# Altium project USBTinyISP.PrjPcb
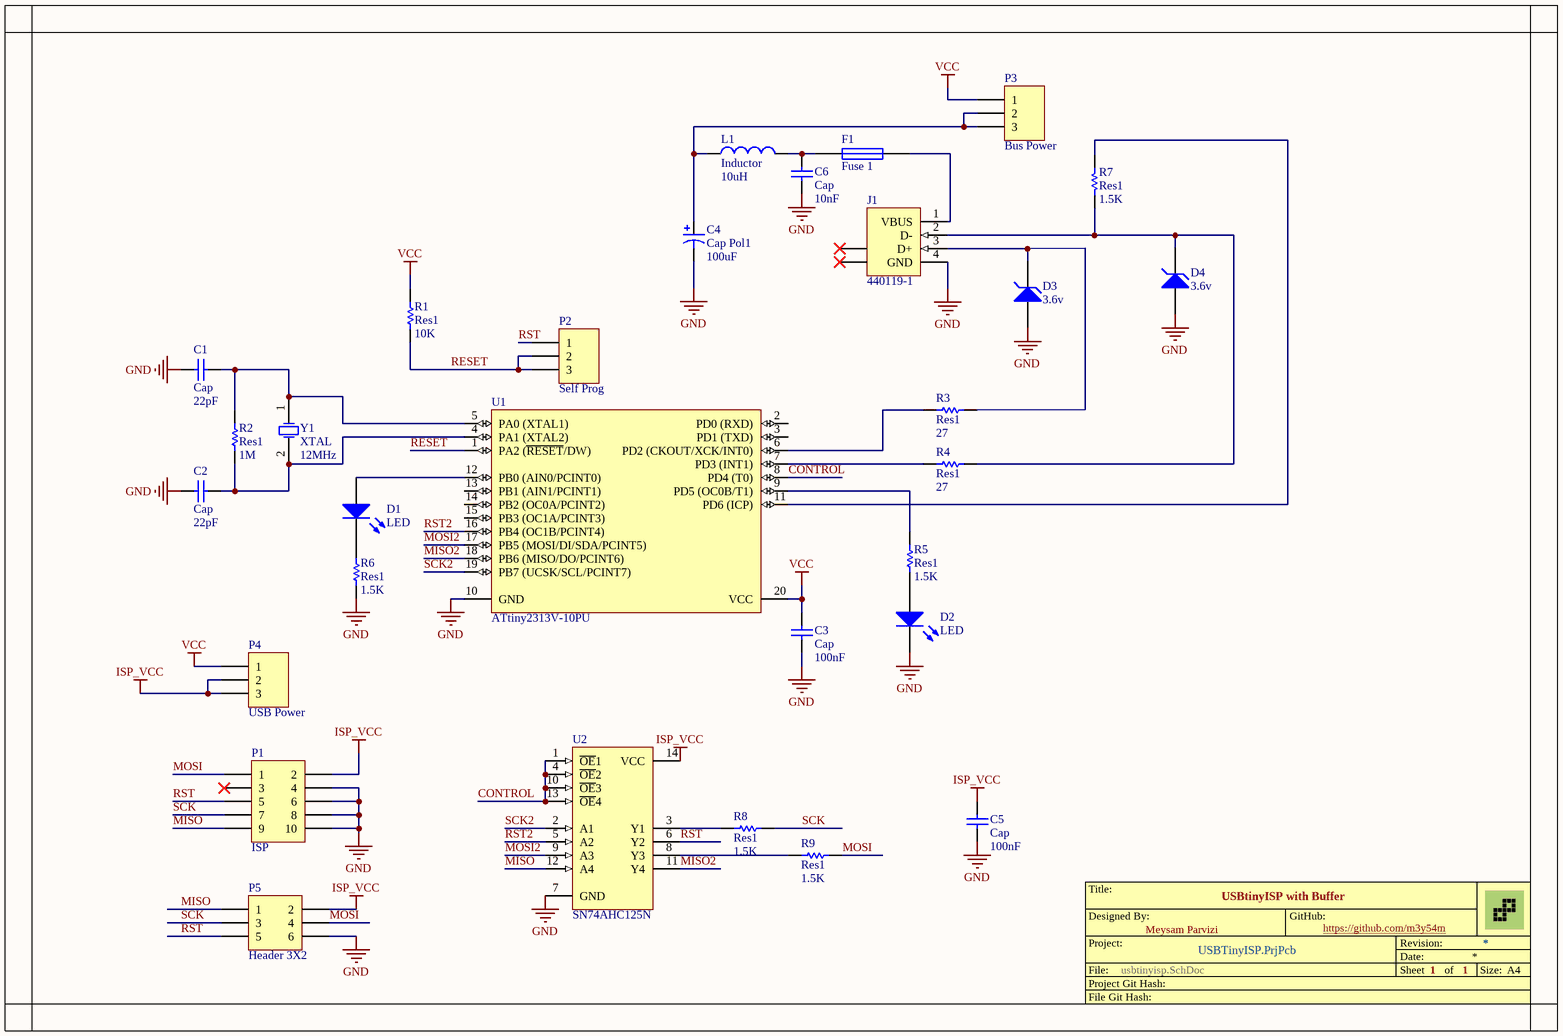
[diagram p0: usbtinyisp.SchDoc]
1 sheet, 30 parts. Net scope: global (net labels, ports and power ports of the same name join across sheets).
Board file: usbtinyisp.PcbDoc

## Sheet usbtinyisp.SchDoc: USBtinyISP with Buffer
size A4; Author: Meysam Parvizi; DrawnBy: Meysam Parvizi; Engineer: Meysam Parvizi; SheetNumber: 1; SheetTotal: 1

### Parts
C1  Cap  value 22pF  [C1206]
C2  Cap  value 22pF  [C1206]
C3  Cap  value 100nF  [C1206]
C4  Cap Pol1  value 100uF  [CAP-SMD1]
C5  Cap  value 100nF  [C1206]
C6  Cap  value 10nF  [C1206]
D1  LED  [3.5X2.8X1.9]
D2  LED  [3.5X2.8X1.9]
D3  3.6v  [DIODE-S]
D4  3.6v  [DIODE-S]
F1  Fuse 1  [C1206]
J1  440119-1  [440119]
L1  Inductor  value 10uH  [C1206]
P1  ISP  [BOX2X5]
P2  Self Prog  [HDR1X3]
P3  Bus Power  [HDR1X3]
P4  USB Power  [HDR1X3]
P5  Header 3X2  [HDR2X3]
R1  Res1  value 10K  [C1206]
R2  Res1  value 1M  [C1206]
R3  Res1  value 27  [C1206]
R4  Res1  value 27  [C1206]
R5  Res1  value 1.5K  [C1206]
R6  Res1  value 1.5K  [C1206]
R7  Res1  value 1.5K  [C1206]
R8  Res1  value 1.5K  [C1206]
R9  Res1  value 1.5K  [C1206]
U1  ATtiny2313V-10PU  [DIP20]
U2  SN74AHC125N  [DIP14]
Y1  XTAL  value 12MHz  [XTAL]

### Nets
GND: C1.1 C2.1 C3.1 C4.2 C5.1 C6.1 D2.2(K) D3.1(A) D4.1(A) J1.4(GND) P1.4 P1.6 P1.8 P1.10 P5.6 R6.2 U1.10(GND) U2.7(GND)
ISP_VCC: C5.2 P1.2 P4.2 P4.3 P5.2 U2.14(VCC)
VCC: C3.2 P3.1 P4.1 R1.2 U1.20(VCC)
CONTROL: U1.8(PD4_(T0)) U2.1(~{OE}1) U2.4(~{OE}2) U2.10(~{OE}3) U2.13(~{OE}4)
MISO: P1.9 P5.1 U2.12(A4)
MISO2: U1.18(PB6_(MISO/DO/PCINT6)) U2.11(Y4)
MOSI: P1.1 P5.4 R9.2
MOSI2: U1.17(PB5_(MOSI/DI/SDA/PCINT5)) U2.9(A3)
RESET: P2.2 P2.3 R1.1 U1.1(PA2_(~{RESET}/DW))
RST: P1.5 P2.1 P5.5 U2.6(Y2)
RST2: U1.16(PB4_(OC1B/PCINT4)) U2.5(A2)
SCK: P1.7 P5.3 R8.2
SCK2: U1.19(PB7_(UCSK/SCL/PCINT7)) U2.2(A1)
NetC1_2: C1.2 R2.2 U1.5(PA0_(XTAL1)) Y1.1(OSC1)
NetC2_2: C2.2 R2.1 U1.4(PA1_(XTAL2)) Y1.2(OSC2)
NetC4_1: C4.1 L1.1 P3.2 P3.3
NetC6_2: C6.2 F1.1 L1.2
NetD1_1: D1.1(A) U1.12(PB0_(AIN0/PCINT0))
NetD1_2: D1.2(K) R6.1
NetD2_1: D2.1(A) R5.2
NetD3_2: D3.2(K) J1.3(D+) R3.1
NetD4_2: D4.2(K) J1.2(D-) R4.1 R7.1
NetF1_2: F1.2 J1.1(VBUS)
NetR3_2: R3.2 U1.6(PD2_(CKOUT/XCK/INT0))
NetR4_2: R4.2 U1.7(PD3_(INT1))
NetR5_1: R5.1 U1.9(PD5_(OC0B/T1))
NetR7_2: R7.2 U1.11(PD6_(ICP))
NetR8_1: R8.1 U2.3(Y1)
NetR9_1: R9.1 U2.8(Y3)

Not connected (* = marked no-connect by the designer): J1 5(SHLD)* 6(SHLD)*; P1 3*; U1 2(PD0_(RXD)) 3(PD1_(TXD)) 13(PB1_(AIN1/PCINT1)) 14(PB2_(OC0A/PCINT2)) 15(PB3_(OC1A/PCINT3))

### Notes on the sheet
- Title:
- Designed By:
- Meysam Parvizi
- GitHub:
- https://github.com/m3y54m
- File:
- Project Git Hash:
- Project:
- Date:
- Sheet
- Revision:
- of
- Size:
- A4
- File Git Hash:

### Library data of the parts
C1-C3 C5 C6 = Cap: Capacitor; Published: 8-Jun-2000; LatestRevisionDate: 17-Jul-2002; LatestRevisionNote: Re-released for DXP Platform.; PackageReference: RAD-0.3; Publisher: Altium Limited; PackageDescription: Radial Cap, Thru-Hole; 2 Leads; 0.3 in Pin Spacing
C4 = Cap Pol1: Polarized Capacitor (Radial); Published: 8-Jun-2000; LatestRevisionDate: 17-Jul-2002; LatestRevisionNote: Re-released for DXP Platform.; PackageReference: RB7.6-15; Publisher: Altium Limited; PackageDescription: Polarized Capacitor (Radial); 2 Leads
D1 D2 = LED: Typical RED GaAs LED; Designer: Meysam Parvizi; Email: meysam.parvizi.ir@gmail.com; Weblog: http://mp.tabin.ir
D3 D4 = D Zener: Zener Diode; Published: 8-Jun-2000; LatestRevisionDate: 17-Jul-2002; LatestRevisionNote: Re-released for DXP Platform.; PackageReference: DIODE-0.7; Publisher: Altium Limited; PackageDescription: Diode, Thru-Hole; 2 Leads; 0.7 in Pin Spacing
F1 = Fuse 1: Fuse; Published: 8-Jun-2000; LatestRevisionDate: 17-Jul-2002; LatestRevisionNote: Re-released for DXP Platform.; PackageReference: PIN-W2/E2.8; Publisher: Altium Limited; PackageDescription: Thru-Hole; 2 Leads
J1 = 440119-1: USB 1.1, Right Angle, Thru-Hole, B Type, Receptacle, 4 Position, Beige; ContactMaterial: Copper Alloy; ContactPlating: Gold Flash over Nickel; TerminationLength: 2.84mm [0.112in.]; PCB_Layout: Complies with manufacturer's recommendation.; DrillSize: Corresponds to nominal value.; PanelGround: Without; Published: 15-Jul-2004; DatasheetDocument: 12-Jan-2004; PackageDocument: 12-Jan-2004; PackageReference: 440119; Publisher: Altium Limited; HousingMaterial: Thermoplastic; ComponentLink1Description: Manufacturer Link; ComponentLink1URL: http://www.tycoelectronics.com/; ComponentLink2Description: Packaging Specification; ComponentLink2URL: http://ecommas.tycoelectronics.com/commerce/DocumentDelivery/DDEController?Action=showdoc&DocId=Customer+Drawing%7F440119%7FC%7Ftif%7FEnglish%7FC_440119_C.tif
L1 = Inductor: Code_IEC: 1005; Published: 8-Jun-2000; LatestRevisionDate: 29-May-2009; LatestRevisionNote: IPC-7351 Footprint Added.; PackageReference: 0402-A; Publisher: Altium Limited; PackageDescription: Chip Inductor; Code_JEITA: 0402
P1 = Box 5X2: Box, 5-Pin, Dual row; Designer: Meysam Parvizi; Email: meysam.parvizi.ir@gmail.com; Weblog: http://mp.tabin.ir
P2-P4 = Header 3: Header, 3-Pin; LatestRevisionDate: 17-Jul-2002; LatestRevisionNote: Re-released for DXP Platform.; Publisher: Altium Limited
P5 = Header 3X2: Header, 3-Pin, Dual row; LatestRevisionDate: 17-Jul-2002; LatestRevisionNote: Re-released for DXP Platform.; Publisher: Altium Limited
R1-R9 = Res1: Resistor; Published: 8-Jun-2000; LatestRevisionDate: 17-Jul-2002; LatestRevisionNote: Re-released for DXP Platform.; PackageReference: AXIAL-0.3; Publisher: Altium Limited; PackageDescription: Axial Device, Thru-Hole; 2 Leads; 0.3 in Pin Spacing
U1 = ATtiny2313V-10PU: Low Power tinyAVR® 8-Bit Microcontroller, 2K Flash Memory, 10MHz, Industrial Temperature, 20-Lead PDIP, Pb-Free; Published: 20-Nov-2009; DatasheetVersion: DOC2543B, Mar-2009; PackageVersion: revC, Jan-2004; PackageReference: 20P3; Publisher: Altium Limited; PackageDescription: 20-lead (0.300"/7.62mm Wide) Plastic Dual Inline Package (PDIP); Supplier 1: Digi-Key; Supplier Part Number 1: ATTINY2313V-10PU-ND; Supplier 2: Farnell; Supplier Part Number 2: 9171614; Supplier 3: Mouser; Supplier Part Number 3: 556-ATTINY2313V10PU; Code_JEDEC: MS-001-AD; ComponentLink1Description: Manufacturer Link; ComponentLink1URL: http://www.atmel.com/products/AVR/tinyavr.asp?; ComponentLink2Description: Datasheet; ComponentLink2URL: http://www.atmel.com/dyn/resources/prod_documents/doc2543.pdf; ComponentLink3Description: Atmel.com Home; ComponentLink3URL: http://www.atmel.com
U2 = SN74AHC125N: Quadruple Bus Buffer Gate with 3-State Outputs; Published: 8-Jun-2000; LatestRevisionDate: 06-Jun-2005; LatestRevisionNote: Stylized 3D Model Added.; DatasheetVersion: Jul-1998; PackageVersion: Oct-1995; PackageReference: N014; Publisher: Altium Limited; PackageDescription: DIP; 14 Leads; Row Spacing 7.62 mm; Pitch 2.54 mm; ComponentLink1Description: Manufacturer Link; ComponentLink1URL: http://www.ti.com/; ComponentLink2Description: Datasheet; ComponentLink2URL: http://www-s.ti.com/sc/ds/sn74ahc125.pdf
Y1 = XTAL: Crystal Oscillator; Designer: Meysam Parvizi; Email: meysam.parvizi.ir@gmail.com; Weblog: http://mp.tabin.ir